# EAGLE board Primary (EAGLE 5.12), part 1 of 2
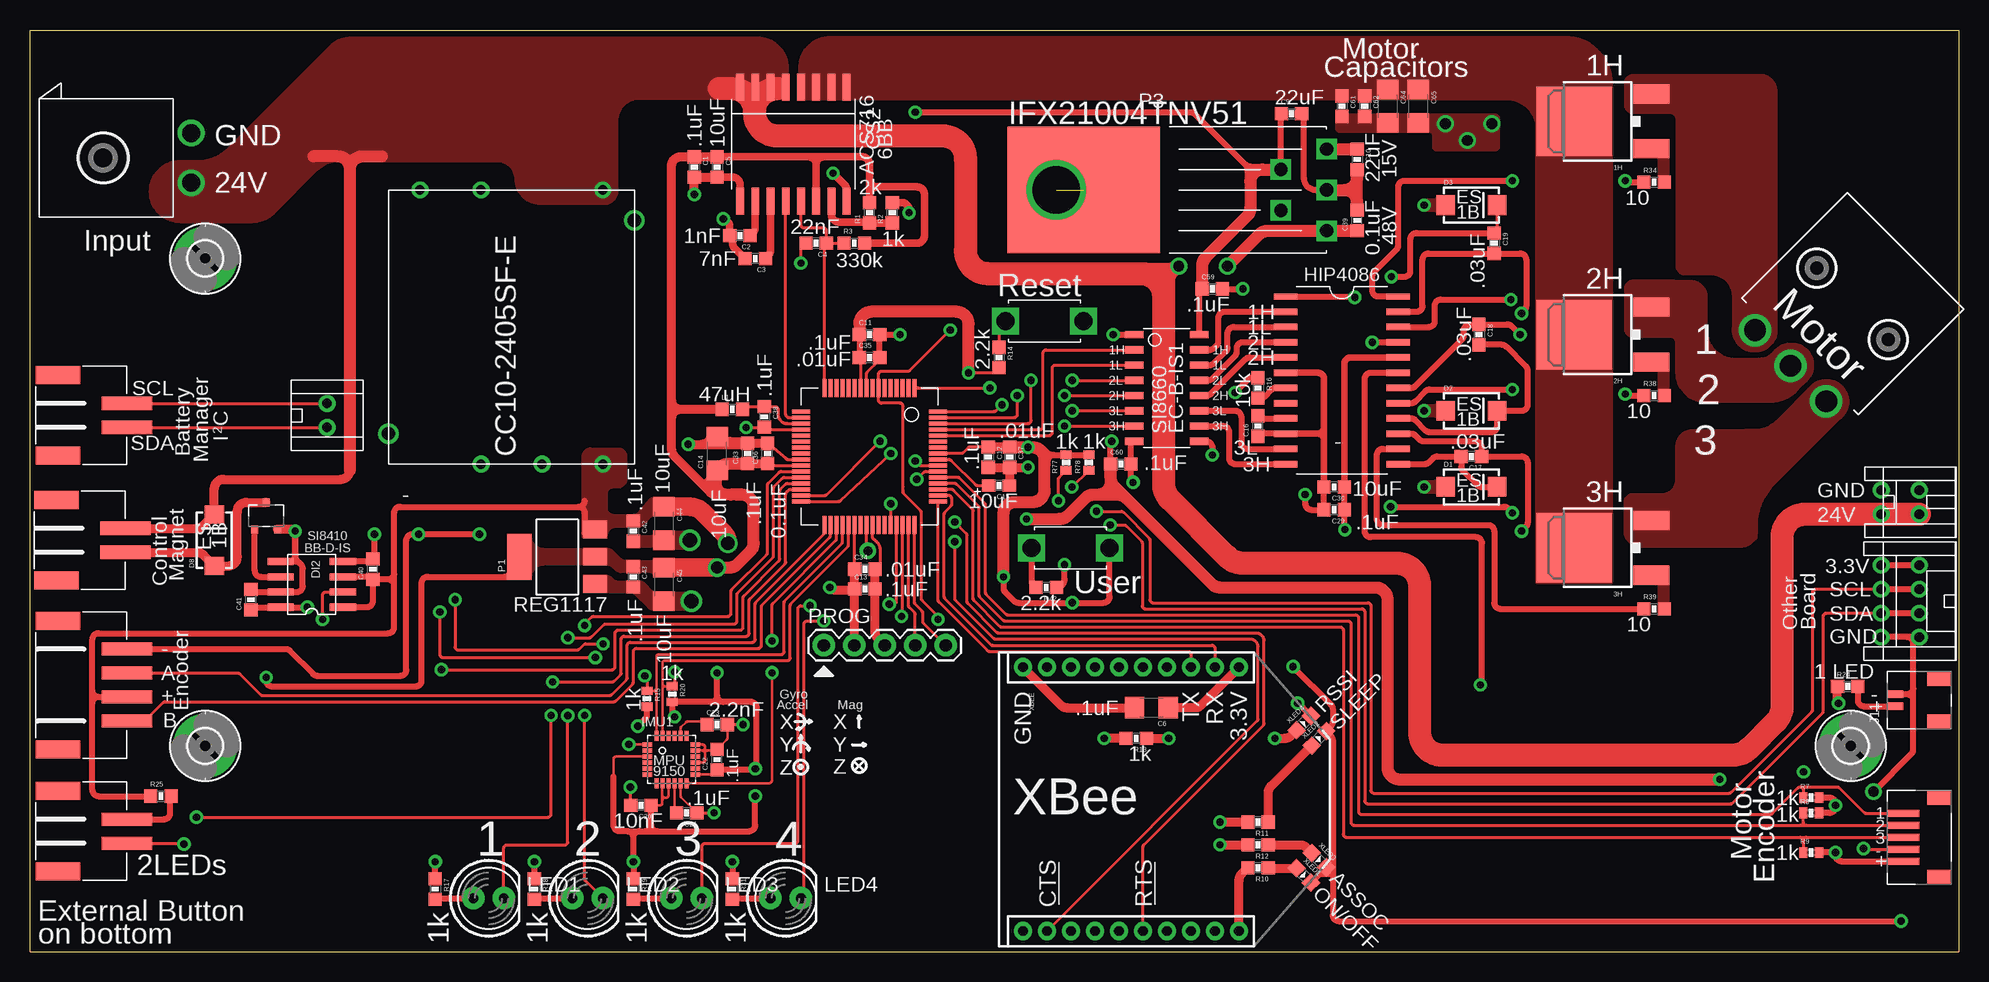
[diagram p4: board, top side]
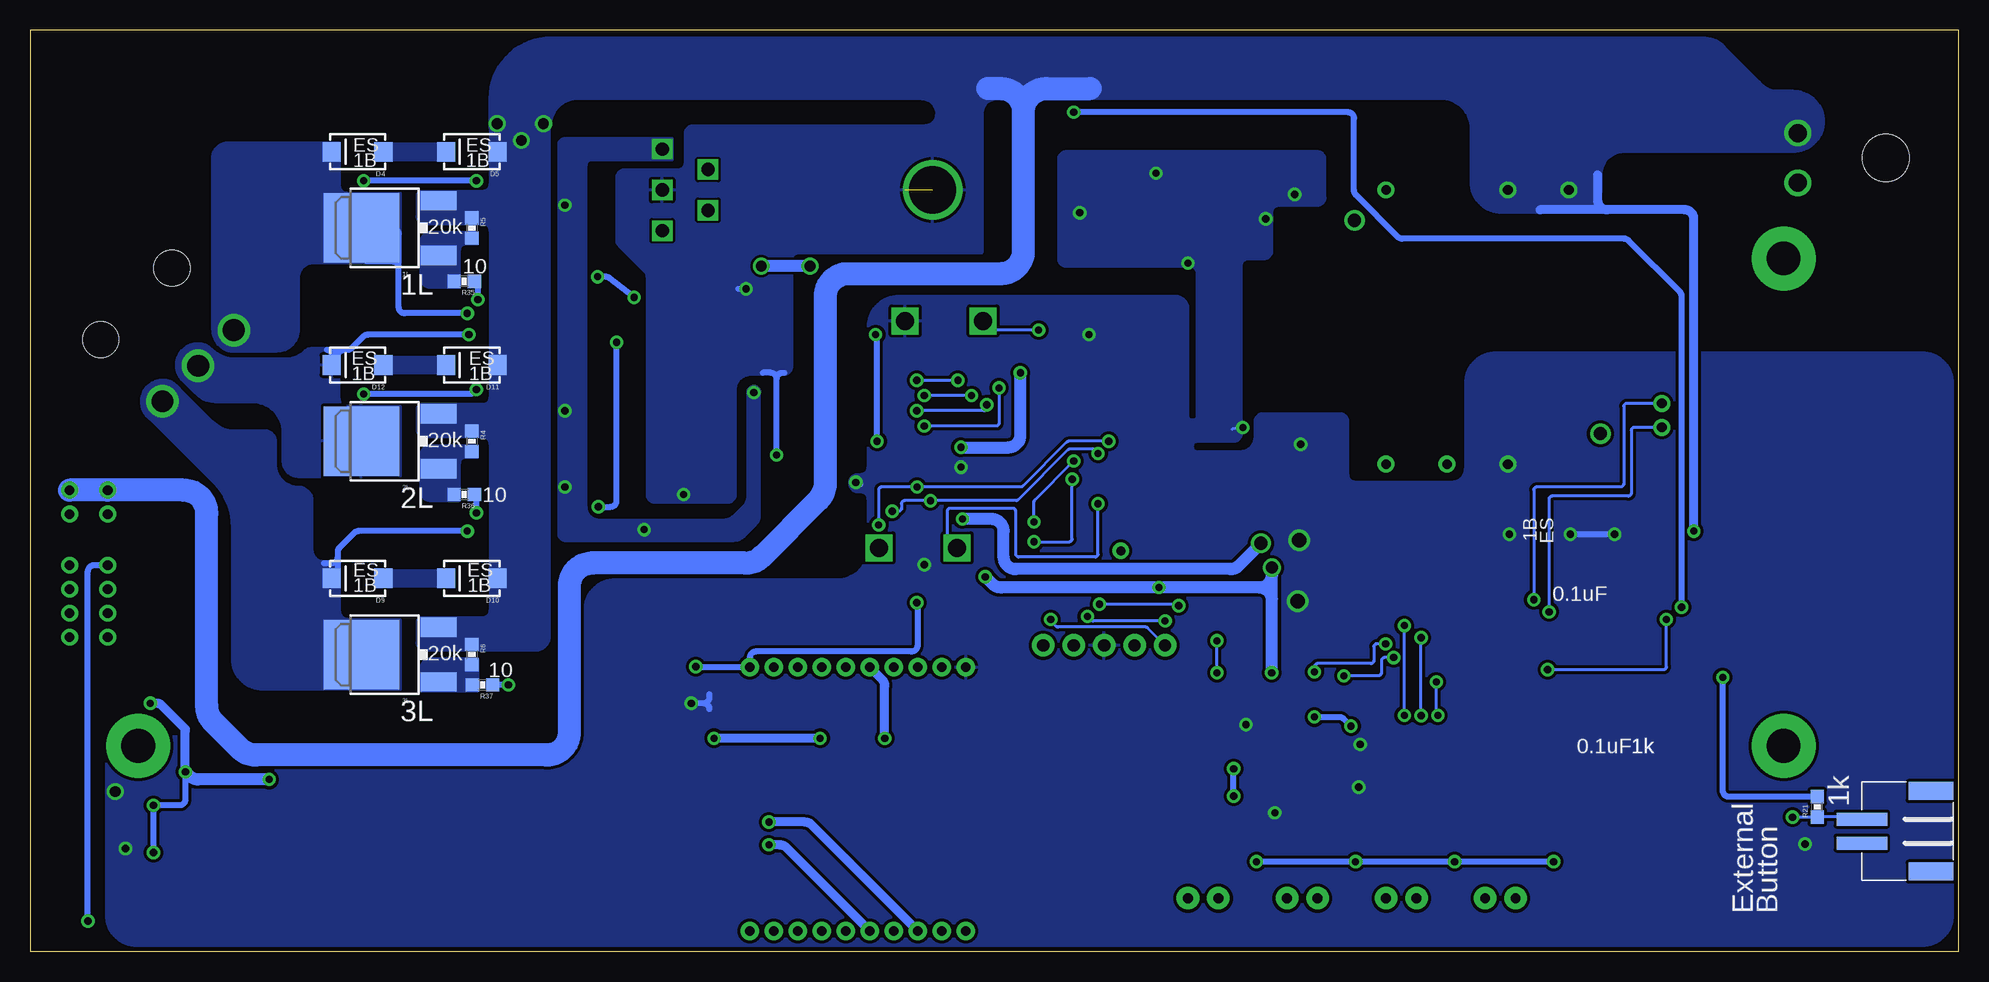
[diagram p5: board, bottom side, seen from below]

Size 160.78 x 76.83 mm. Coordinates in mm from the lower left corner, seen from the top.
Outline: 0,0 160.78,0 160.78,76.83 0,76.83 0,0
Copper layers (1*16): Top 0.035mm / dielectric 1.5mm / Bottom 0.035mm
Design rules "SparkFun *": minimum track width 8mil, minimum drill 20mil, track to track 8mil, track to pad 8mil, pad to pad 5mil, via to via 8mil, smd to smd 5mil, copper to edge 10mil, drill to drill 8mil, minimum pad ring 12mil, minimum via ring 10mil, stop-mask expansion 4mil, vias tented up to drill 25mil, thermal gap 10mil

## Footprints (pad centres in the part's own frame; a part is rotated, then mirrored left to right if it is on the bottom)
DPAK = smd 5.791 x 6.274: D 0,1.587 | smd 1.6 x 3: G -2.286,-4.851; S 2.286,-4.851
JST-2-PH-SMD = smd 1.1 x 4.2: 1 -1,-7.7; 2 1,-7.7 | smd 1.5 x 3.7: P$1 -3.35,-1.95; P$4 3.35,-1.95
0603 = smd 1.1 x 1.1: 1 -0.85,0; 2 0.85,0
1206 = smd 1.6 x 1.8: 1 -1.4,0; 2 1.4,0
0603-POL = smd 1.1 x 1: + 0.85,0; - -0.85,0
SOIC16-W = smd 0.65 x 2.25: 1 -4.445,-4.75; 2 -3.175,-4.75; 3 -1.905,-4.75; 4 -0.635,-4.75; 5 0.635,-4.75; 6 1.905,-4.75; 7 3.175,-4.75; 8 4.445,-4.75; 9 4.445,4.75; 10 3.175,4.75; 11 1.905,4.75; 12 0.635,4.75; 13 -0.635,4.75; 14 -1.905,4.75; 15 -3.175,4.75; 16 -4.445,4.75
SMA-DIODE = smd 1.52 x 1.63: A -2.15,0; C 2.15,0
SOIC16-N = smd 0.6 x 1.55: 1 -4.445,-2.7; 2 -3.175,-2.7; 3 -1.905,-2.7; 4 -0.635,-2.7; 5 0.635,-2.7; 6 1.905,-2.7; 7 3.175,-2.7; 8 4.445,-2.7; 9 4.445,2.7; 10 3.175,2.7; 11 1.905,2.7; 12 0.635,2.7; 13 -0.635,2.7; 14 -1.905,2.7; 15 -3.175,2.7; 16 -4.445,2.7
SOIC8-N = smd 2.2 x 0.6: 1 -2.6,1.905; 2 -2.6,0.635; 3 -2.6,-0.635; 4 -2.6,-1.905; 5 2.6,-1.905; 6 2.6,-0.635; 7 2.6,0.635; 8 2.6,1.905
2,8-PAD = drill 2.8 pad 5.334 round: B2,8 0,0
LGA24_4X4 = smd 0.8 x 0.35: 1 -2,1.25; 2 -2,0.75; 3 -2,0.25; 4 -2,-0.25; 5 -2,-0.75; 6 -2,-1.25; 13 2,-1.25; 14 2,-0.75; 15 2,-0.25; 16 2,0.25; 17 2,0.75; 18 2,1.25 | smd 0.35 x 0.85: 7 -1.25,-1.975; 8 -0.75,-1.975; 9 -0.25,-1.975; 10 0.25,-1.975; 11 0.75,-1.975; 12 1.25,-1.975; 19 1.25,1.975; 20 0.75,1.975; 21 0.25,1.975; 22 -0.25,1.975; 23 -0.75,1.975; 24 -1.25,1.975
JST-4-PH-SMD = smd 1.1 x 4.2: 1 -3,-7.7; 2 -1,-7.7; 3 1,-7.7; 4 3,-7.7 | smd 1.5 x 3.7: P$1 -5.35,-1.95; P$2 5.35,-1.95
JST-5-SH = smd 0.6 x 2.7: 1 2,4; 2 1,4; 3 0,4; 4 -1,4; 5 -2,4 | smd 1.2 x 2: P$6 -3.3,1; P$7 3.3,1
JST-2-PH-TH = drill 0.8 round: 1 -1,-6.35; 2 1,-6.35
JST-SH-2 = smd 0.6 x 1.35: 1 0.5,4.675; 2 -0.5,4.675 | smd 1.2 x 2: P$6 -1.8,1; P$7 1.8,1
1X01_TEST = drill 0.762 round: 1 0,0
TE-MINIMATENLOK-2 = drill 1.48 round: 1 -2.07,12.67; 2 2.07,12.67 | hole 3.91: 0,5.33
JST-2-PH-V = drill 0.8 round: 1 -1,0; 2 1,0
MOLEX-3-MINIFITJR-RA = drill 1.803 round: 1 4.191,13.538; 2 0,13.538; 3 -4.191,13.538 | hole 3: -4.204,6.248; 4.204,6.248
JST-4-PH-TH = drill 0.8 round: 1 -3,-6.35; 2 -1,-6.35; 3 1,-6.35; 4 3,-6.35
JST-4-PH-V = drill 0.8 round: 1 -3,0; 2 -1,0; 3 1,0; 4 3,0
LED5MM = drill 0.813 pad 1.88 round: A -1.27,0; K 1.27,0
SOT23F = smd 0.6 x 0.65: D 0,1.125; G -0.95,-1.125; S 0.95,-1.125
SOIC24-W = smd 0.533 x 1.981: 1 -6.985,-4.686; 2 -5.715,-4.686; 3 -4.445,-4.686; 4 -3.175,-4.686; 5 -1.905,-4.686; 6 -0.635,-4.686; 7 0.635,-4.686; 8 1.905,-4.686; 9 3.175,-4.686; 10 4.445,-4.686; 11 5.715,-4.686; 12 6.985,-4.686; 13 6.985,4.686; 14 5.715,4.686; 15 4.445,4.686; 16 3.175,4.686; 17 1.905,4.686; 18 0.635,4.686; 19 -0.635,4.686; 20 -1.905,4.686; 21 -3.175,4.686; 22 -4.445,4.686; 23 -5.715,4.686; 24 -6.985,4.686
SOT223 = smd 1.499 x 2.007: 1 -2.261,-3.15; 2 0.025,-3.15; 3 2.311,-3.15 | smd 3.81 x 2.007: 4 0,3.15
CC6-2405SF-E = drill 0.8 round: 1 -11.43,7.62; 2 -11.43,-2.54; 3 -11.43,-7.62; 5 11.43,-2.54; 6 11.43,2.54; 7 11.43,7.62 | drill 1.1 round: P$9 8.89,-10.25; P$10 -8.89,10.25
TO220-5 = drill 1.1 square: 1 3.81,-3.404; 2 0,-1.702; 3 3.81,0; 4 0,1.702; 5 3.81,3.404 | smd 12.7 x 10.541: PAD -16.434,0 | drill 3.937 round: PAD2 -18.72,0
TQFP64_10X10 = smd 1.5 x 0.3: 1 -5.7,3.75; 2 -5.7,3.25; 3 -5.7,2.75; 4 -5.7,2.25; 5 -5.7,1.75; 6 -5.7,1.25; 7 -5.7,0.75; 8 -5.7,0.25; 9 -5.7,-0.25; 10 -5.7,-0.75; 11 -5.7,-1.25; 12 -5.7,-1.75; 13 -5.7,-2.25; 14 -5.7,-2.75; 15 -5.7,-3.25; 16 -5.7,-3.75; 33 5.7,-3.75; 34 5.7,-3.25; 35 5.7,-2.75; 36 5.7,-2.25; 37 5.7,-1.75; 38 5.7,-1.25; 39 5.7,-0.75; 40 5.7,-0.25; 41 5.7,0.25; 42 5.7,0.75; 43 5.7,1.25; 44 5.7,1.75; 45 5.7,2.25; 46 5.7,2.75; 47 5.7,3.25; 48 5.7,3.75 | smd 0.3 x 1.5: 17 -3.75,-5.7; 18 -3.25,-5.7; 19 -2.75,-5.7; 20 -2.25,-5.7; 21 -1.75,-5.7; 22 -1.25,-5.7; 23 -0.75,-5.7; 24 -0.25,-5.7; 25 0.25,-5.7; 26 0.75,-5.7; 27 1.25,-5.7; 28 1.75,-5.7; 29 2.25,-5.7; 30 2.75,-5.7; 31 3.25,-5.7; 32 3.75,-5.7; 49 3.75,5.7; 50 3.25,5.7; 51 2.75,5.7; 52 2.25,5.7; 53 1.75,5.7; 54 1.25,5.7; 55 0.75,5.7; 56 0.25,5.7; 57 -0.25,5.7; 58 -0.75,5.7; 59 -1.25,5.7; 60 -1.75,5.7; 61 -2.25,5.7; 62 -2.75,5.7; 63 -3.25,5.7; 64 -3.75,5.7
1X05 = drill 1.016 pad 1.88 round: 1 0,0; 2 2.54,0; 3 5.08,0; 4 7.62,0; 5 10.16,0
0402 = smd 0.7 x 0.9: 1 -0.65,0; 2 0.65,0
TACTILE_SWITCH = drill 1.5 square: 1 -3.25,0; 2 3.25,0
XBEE-SILK = drill 0.8 pad 1.524 round: 1 -11,20; 2 -11,18; 3 -11,16; 4 -11,14; 5 -11,12; 6 -11,10; 7 -11,8; 8 -11,6; 9 -11,4; 10 -11,2; 11 11,2; 12 11,4; 13 11,6; 14 11,8; 15 11,10; 16 11,12; 17 11,14; 18 11,16; 19 11,18; 20 11,20
0603-DIODE = smd 1.1 x 1.1: AN -0.85,0; CAT 0.85,0

## Placement (x,y rotation side)
1H  IRLR024  [DPAK]  130.3,69.22 90 top
1L  IRLR024  [DPAK]  131.57,60.33 90 bottom
2H  IRLR024  [DPAK]  130.3,51.44 90 top
2L  IRLR024  [DPAK]  131.57,42.55 90 bottom
3H  IRLR024  [DPAK]  130.3,33.66 90 top
3L  IRLR024  [DPAK]  131.57,24.77 90 bottom
BUTTON  [JST-2-PH-SMD]  0.38,10.03 270 bottom
C1  .1uF  [0603]  55.37,65.41 270 top
C2  1nF  [0603]  59.18,59.69 180 top
C3  7nF  [0603]  60.45,57.78 180 top
C4  22nF  [0603]  65.53,59.05 180 top
C5  10uF  [0603]  57.28,65.41 270 top
C6  .1uF  [1206]  93.47,20.32 180 top
C9  22uF  [0603]  105.16,69.85 0 top
C10  22uF 15V  [0603]  110.62,66.04 270 top
C11  .1uF  [0603]  69.98,51.44 0 top
C12  .1uF  [0603]  79.88,41.22 270 top
C13  .1uF  [0603]  69.6,30.23 0 top
C14  10uF  [1206]  57.28,41.53 90 top
C15  10uF  [0603-POL]  80.77,38.86 180 top
C16  DNI  [0603]  102.36,43.81 90 top
C17  .03uF 15V  [0603]  120.14,41.27 180 top
C18  .03uF 15V  [0603]  120.78,51.44 270 top
C19  .03uF 15V  [0603]  122.05,59.05 270 top
C20  10nF  [0603]  50.93,12.19 180 top
C21  .1uF  [0603]  54.74,11.56 180 top
C22  .1uF  [0603]  57.28,16 90 top
C23  2.2nF  [0603]  57.28,18.92 0 top
C29  .1uF  [0603]  108.71,36.83 180 top
C30  10uF  [0603]  108.71,38.73 180 top
C33  .1uF  [0603]  59.82,41.53 90 top
C34  .01uF  [0603]  69.6,31.88 0 top
C35  .01uF  [0603]  69.98,49.53 0 top
C36  .01uF  [0603]  61.47,41.53 90 top
C37  .01uF  [0603]  81.66,41.22 270 top
C38  .1uF  [0603]  61.21,44.58 270 top
C39  .1uF 48V  [0603]  110.62,60.96 90 top
C40  .1uF  [0603]  28.57,31.88 90 top
C41  .1uF  [0603]  18.41,29.34 90 top
C42  .1uF  [0603]  50.29,35.05 270 top
C43  .1uF  [0603]  50.29,31.24 270 top
C44  10uF  [1206]  52.83,35.69 270 top
C45  10uF  [1206]  52.83,30.61 270 top
C59  .1uF  [0603]  98.55,55.24 0 top
C60  .1uF  [0603]  90.93,40.64 0 top
C61  .01uF  [0603]  109.35,70.48 270 top
C62  .1uF  [0603]  111.25,70.48 270 top
C64  1uF  [1206]  113.16,70.48 270 top
C65  10uF  [1206]  115.7,70.48 270 top
CS2  ACS716KLATR-6BB-T  [SOIC16-W]  63.63,67.31 180 top
D1  ES1B  [SMA-DIODE]  120.14,38.73 0 top
D2  ES1B  [SMA-DIODE]  120.14,45.09 0 top
D3  ES1B  [SMA-DIODE]  120.14,62.23 0 top
D4  ES1B  [SMA-DIODE]  133.48,66.67 180 bottom
D5  ES1B  [SMA-DIODE]  123.95,66.67 180 bottom
D8  ES1B  [SMA-DIODE]  15.37,34.29 90 top
D9  ES1B  [SMA-DIODE]  133.48,31.11 180 bottom
D10  ES1B  [SMA-DIODE]  123.95,31.11 180 bottom
D11  ES1B  [SMA-DIODE]  123.95,48.9 180 bottom
D12  ES1B  [SMA-DIODE]  133.48,48.9 180 bottom
DI1  DIGITAL-ISOLATOR-6CH  [SOIC16-N]  94.74,46.99 270 top
DI2  DIGITAL-ISOLATOR-1CHSOIC8-N  [SOIC8-N]  23.5,30.61 180 top
H1  MOUNT-PAD-ROUND2.8  [2,8-PAD]  14.61,57.78 0 top
H2  MOUNT-PAD-ROUND2.8  [2,8-PAD]  14.61,17.14 0 top
H3  MOUNT-PAD-ROUND2.8  [2,8-PAD]  151.76,17.14 0 top
IMU1  MPU-9150  [LGA24_4X4]  53.47,16 0 top
J2  [JST-4-PH-SMD]  0.38,22.23 90 top
J3  [JST-2-PH-SMD]  0.38,44.7 90 top
J5  [JST-5-SH]  160.15,9.53 90 top
J7  [JST-2-PH-TH]  160.66,37.47 270 top
J10  [JST-2-PH-SMD]  0.38,10.03 90 top
J11  [JST-SH-2]  160.15,20.95 90 top
J14  [JST-2-PH-SMD]  0.25,34.29 90 top
JP1  M01TEST  [1X01_TEST]  69.85,33.4 0 top
JP2  [TE-MINIMATENLOK-2]  0.76,66.17 270 top
JP3  [JST-2-PH-V]  157.48,37.47 90 top
JP5  [JST-2-PH-V]  24.77,44.7 90 top
JP6  [MOLEX-3-MINIFITJR-RA]  156.34,58.42 135 top
JP7  [JST-4-PH-TH]  160.66,29.21 270 top
JP8  [JST-4-PH-V]  157.48,29.21 270 top
L1  47uH  [0603]  58.55,45.21 0 top
LED1  [LED5MM]  38.23,4.45 0 top
LED2  [LED5MM]  46.48,4.45 0 top
LED3  [LED5MM]  54.74,4.45 0 top
LED4  [LED5MM]  62.99,4.45 0 top
M1  N-MOSSOT23F  [SOT23F]  19.68,36.32 0 top
MD1  HIP4086  [SOIC24-W]  109.35,47.62 270 top
P1  LINEAR-REGREG1117  [SOT223]  43.94,32.89 90 top
P2  CC10-2405SF-E  [CC6-2405SF-E]  40.13,52.07 270 top
P3  IFX21004TNV51  [TO220-5]  104.27,63.5 0 top
PIC1  DSPIC33EP512MC806  [TQFP64_10X10]  69.98,41.27 270 top
PROG  [1X05]  66.17,25.53 0 top
R1  2k  [0603]  69.98,61.59 90 top
R2  1k  [0603]  71.88,61.59 90 top
R3  330k  [0603]  68.71,59.05 0 top
R4  20k  [0603]  123.95,42.55 270 bottom
R5  20k  [0603]  123.95,60.33 270 bottom
R6  20k  [0603]  123.95,24.77 270 bottom
R7  1k  [0402]  148.46,12.83 0 top
R8  1k  [0402]  148.46,11.56 0 top
R9  1k  [0402]  148.46,8.26 0 top
R10  1k  [0603]  102.36,6.99 180 top
R11  1k  [0603]  102.36,10.79 180 top
R12  1k  [0603]  102.36,8.89 180 top
R13  1k  [0603]  92.2,17.78 180 top
R14  2.2k  [0603]  80.77,49.53 270 top
R15  10k  [0402]  51.44,21.08 270 top
R16  10k  [0603]  102.36,46.99 270 top
R17  1k  [0603]  33.78,5.21 270 top
R18  1k  [0603]  42.04,5.21 270 top
R19  1k  [0603]  50.29,5.21 270 top
R20  10k  [0402]  53.53,21.46 270 top
R21  1k  [0603]  11.81,12.06 90 bottom
R24  47  [0603]  151.51,22.1 0 top
R25  22  [0603]  10.92,12.95 0 top
R31  1k  [0603]  58.55,5.21 270 top
R34  10ohm  [0603]  135.38,64.14 0 top
R35  10ohm  [0603]  124.59,55.88 180 bottom
R36  10ohm  [0603]  124.59,38.1 180 bottom
R37  10ohm  [0603]  123.06,22.23 180 bottom
R38  10ohm  [0603]  135.38,46.35 0 top
R39  10ohm  [0603]  135.38,28.57 0 top
R42  2.2k  [0603]  84.71,30.35 180 top
R77  1k  [0402]  86.36,40.77 90 top
R78  1k  [0402]  88.27,40.77 90 top
RESET1  TACTILE_SWITCH  [TACTILE_SWITCH]  84.58,52.58 0 top
USER1  TACTILE_SWITCH  [TACTILE_SWITCH]  86.74,33.66 180 top
XBEE  XBEETH  [XBEE-SILK]  80.77,12.7 270 top
XLED1  [0603-DIODE]  106.17,6.35 315 top
XLED2  [0603-DIODE]  107.44,17.78 45 top
XLED3  [0603-DIODE]  107.44,7.62 315 top
XLED4  [0603-DIODE]  106.17,19.05 45 top